# Altium project uz_mz_adapter.PrjPcb
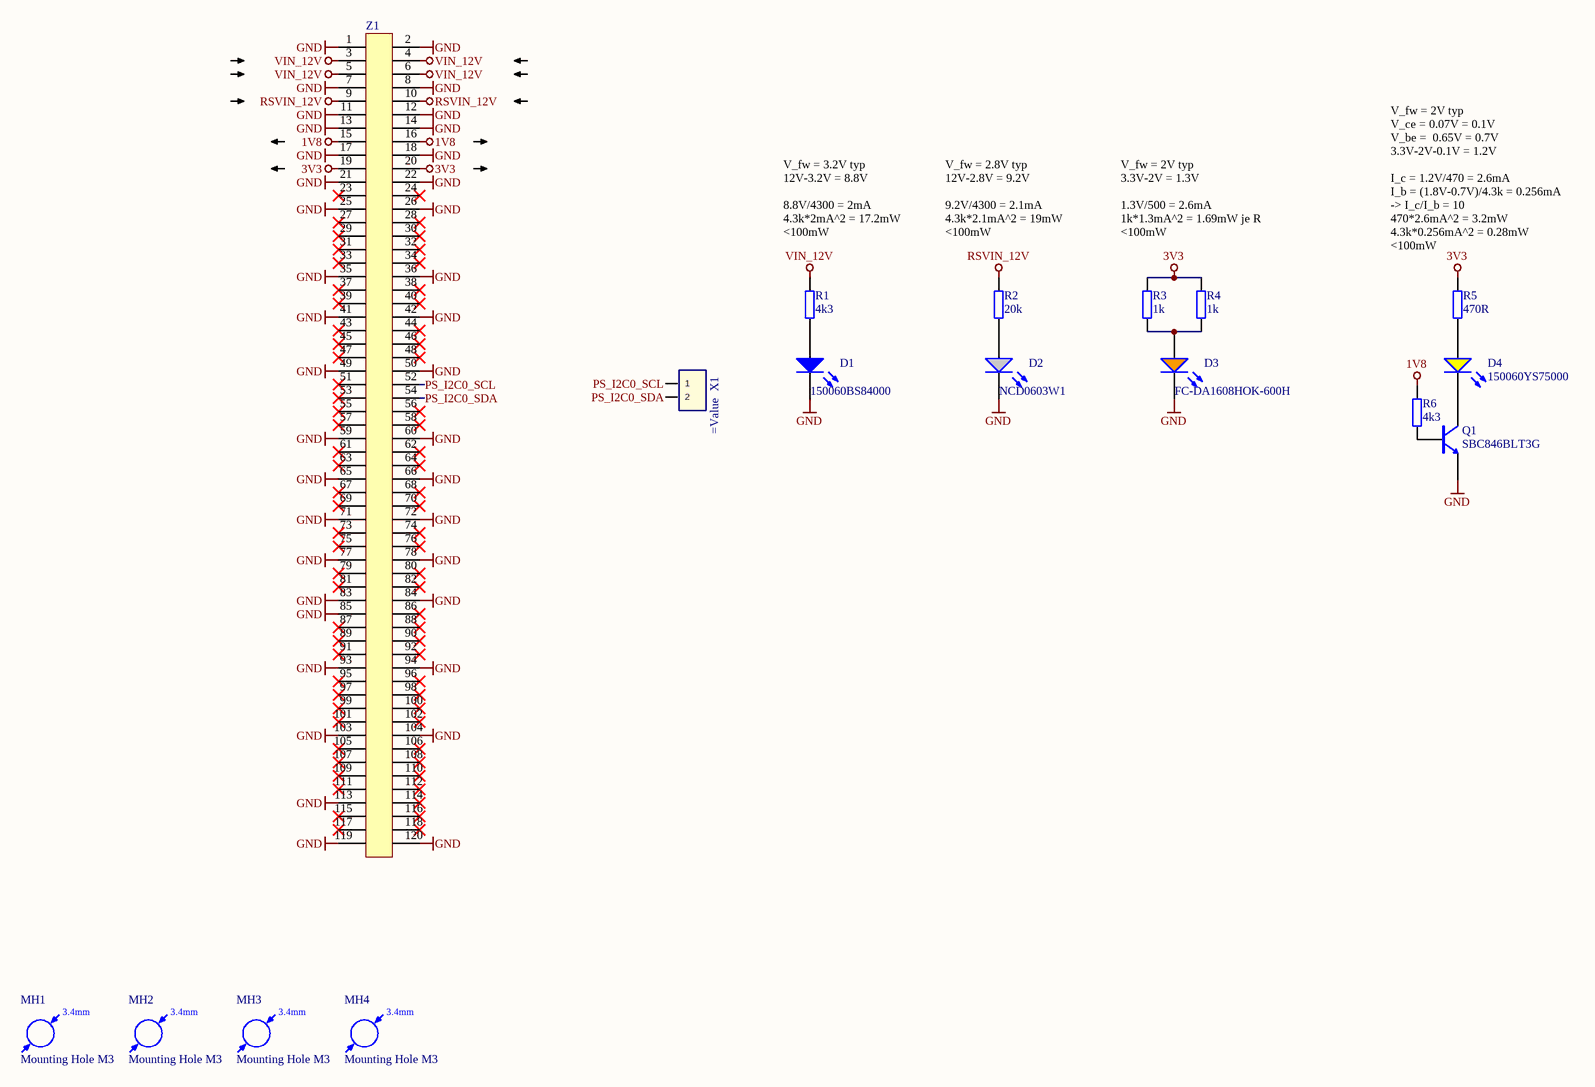
[diagram p0: ZB1.SchDoc]
AuthorParam: R. Weimer; Project: uz_mz_adapter; ProjectDate: 06/2026; ProjectRevision: Rev01
3 sheets, 36 parts. Net scope: global (net labels, ports and power ports of the same name join across sheets).
Board file: uz_mz_adapter.PcbDoc
Sheets:
  ZB1.SchDoc
  ZB2.SchDoc
  ZB3.SchDoc

## Sheet ZB1.SchDoc
size A3; SheetNumber: 1; SheetTotal: 3

### Parts
D1  150060BS84000  [WL-SMCW_0603]
D2  NCD0603W1  [WL-SMCW_0603]
D3  FC-DA1608HOK-600H  [WL-SMCW_0603]
D4  150060YS75000  [WL-SMCW_0603]
MH1  Mounting Hole M3  [MH_3.4]  (no BOM)
MH2  Mounting Hole M3  [MH_3.4]  (no BOM)
MH3  Mounting Hole M3  [MH_3.4]  (no BOM)
MH4  Mounting Hole M3  [MH_3.4]  (no BOM)
Q1  SBC846BLT3G  [SOT-23-3_ONSC]
R1  4k3  [RES 0603_1608]
R2  20k  [RES 0603_1608]
R3  1k  [RES 0603_1608]
R4  1k  [RES 0603_1608]
R5  470R  [RES 0603_1608]
R6  4k3  [RES 0603_1608]
X1  (no value)  [TSW-102-XX-XXX-S]
Z1  (no value)  [ERM8-060-02.0-L-DV]

### Nets
1V8: R6.2 Z1.15 Z1.16
3V3: R3.2 R4.2 R5.2 Z1.19 Z1.20
GND: D1.1(K) D2.1(K) D3.1(K) Q1.2(EMITTER) Z1.1 Z1.2 Z1.7 Z1.8 Z1.11 Z1.12 Z1.13 Z1.14 Z1.17 Z1.18 Z1.21 Z1.22 Z1.25 Z1.26 Z1.35 Z1.36 Z1.41 Z1.42 Z1.49 Z1.50 Z1.59 Z1.60 Z1.65 Z1.66 Z1.71 Z1.72 Z1.77 Z1.78 Z1.83 Z1.84 Z1.85 Z1.93 Z1.94 Z1.103 Z1.104 Z1.113 Z1.119 Z1.120
RSVIN_12V: R2.2 Z1.9 Z1.10
VIN_12V: R1.2 Z1.3 Z1.4 Z1.5 Z1.6
PS_I2C0_SCL: X1.1 Z1.52
PS_I2C0_SDA: X1.2 Z1.54
NetD1_2: D1.2(A) R1.1
NetD2_2: D2.2(A) R2.1
NetD3_2: D3.2(A) R3.1 R4.1
NetD4_1: D4.1(K) Q1.3(COLLECTOR)
NetD4_2: D4.2(A) R5.1
NetQ1_1: Q1.1(BASIS) R6.1

Not connected (* = marked no-connect by the designer): Z1 23* 24* 27* 28* 29* 30* 31* 32* 33* 34* 37* 38* 39* 40* 43* 44* 45* 46* 47* 48* 51* 53* 55* 56* 57* 58* 61* 62* 63* 64* 67* 68* 69* 70* 73* 74* 75* 76* 79* 80* 81* 82* 86* 87* 88* 89* 90* 91* 92* 95* 96* 97* 98* 99* 100* 101* 102* 105* 106* 107* 108* 109* 110* 111* 112* 114* 115* 116* 117* 118*

### Notes on the sheet
- V_fw = 3.2V typ
  12V-3.2V = 8.8V
  8.8V/4300 = 2mA
  4.3k*2mA^2 = 17.2mW
  <100mW
- V_fw = 2.8V typ
  12V-2.8V = 9.2V
  9.2V/4300 = 2.1mA
  4.3k*2.1mA^2 = 19mW
  <100mW
- V_fw = 2V typ
  3.3V-2V = 1.3V
  1.3V/500 = 2.6mA
  1k*1.3mA^2 = 1.69mW je R
  <100mW
- (near R5) V_fw = 2V typ
  V_ce = 0.07V = 0.1V
  V_be =  0.65V = 0.7V
  3.3V-2V-0.1V = 1.2V
  I_c = 1.2V/470 = 2.6mA
  I_b = (1.8V-0.7V)/4.3k = 0.256mA
  -> I_c/I_b = 10
  470*2.6mA^2 = 3.2mW
  4.3k*0.256mA^2 = 0.28mW
  <100mW
- Title
- Revision:
- Design Engineer:
- Date:
- Project:
- Sheet
- of
- (in symbol Mounting Hole) 3.4mm

### Library data of the parts
D1 = 150060BS84000: WL-SMCW SMD Mono-color Chip LED Waterclear Blue; Manufacturer: Wuerth Elektronik; Type: Standard; Created from: MGremer; Forward Current I_f: 20 mA; Forward Voltage U_f: 3.2 V; Wavelength: 470 nm; Light Intensity: 560 mcd; Nominal Power: 78 mW; Manufacturer Part Number: 150060BS84000; PartID: 1; Created On: 08.12.2020 10:19:38; ComponentLink1Description: Datasheet; ComponentLink1URL: https://www.we-online.com/components/products/datasheet/150060BS75000.pdf; Component Type: LED Diode; Device Package: 0603; Last Updated: 22.04.2026 11:55:05; Mounting Type: SMD; Operating Temperature: -40 - 85 °C; Supplier 1: Mouser; Supplier Part Number 1: 710-150060BS84000; Supplier 2: Farnell; Supplier Part Number 2: 3408611; Supplier 3: Digi-Key; Supplier Part Number 3: 732-150060BS84000CT-ND; Live Cycle Status: 1; Stock number: not stored; Color: blue; LCSC Part Number: C5197644
D2 = NCD0603W1: White light 0603 Light Emitting Diodes (LED) ROHS; Manufacturer: Foshan NationStar Optoelectronics; Type: Standard; Created from: NDiringer; Forward Current I_f: 20 mA; Forward Voltage U_f: 2.8 V; Light Intensity: 250 mcd; Nominal Power: 72 mW; Manufacturer Part Number: NCD0603W1; PartID: 13; Created On: 03.05.2022 13:11:03; ComponentLink1Description: Datasheet; ComponentLink1URL: https://www.lcsc.com/datasheet/C84265.pdf; Component Type: LED Diode; Device Package: 0603; Last Updated: 22.04.2026 11:55:05; Mounting Type: SMD; Operating Temperature: -40 - 85 °C; Supplier 1: LCSC; Supplier Part Number 1: C84265; Live Cycle Status: 1; Stock number: not stored; Color: white; LCSC Part Number: C84265
D3 = FC-DA1608HOK-600H: LED ORANGE 600~610NM 80~220MCD@20MA TOP VIEW 0603 ROHS; Manufacturer: Foshan NationStar Optoelectronics; Type: Standard; Created from: T. Wendt; Color: amber; Forward Current I_f: 20 mA; Forward Voltage U_f: 2 V; Wavelength: 604 nm; Light Intensity: 150 mcd; Nominal Power: 40 mW; Manufacturer Part Number: FC-DA1608HOK-600H; PartID: 10; Created On: 03.03.2021 09:59:51; ComponentLink1Description: Datasheet; ComponentLink1URL: https://www.lcsc.com/datasheet/C84269.pdf; Component Type: LED Diode; Device Package: 0603; Last Updated: 22.04.2026 11:55:05; Mounting Type: SMD; Operating Temperature: -40 - 85 °C; Supplier 1: LCSC; Supplier Part Number 1: C84269; Live Cycle Status: 1; Stock number: not stored; LCSC Part Number: C84269
D4 = 150060YS75000: LED Yellow 20mA 2V 0603; Manufacturer: Wuerth Elektronik; Type: Standard; Created from: RWeimer; Wavelength: 590 nm; Manufacturer Part Number: 150060YS75000; PartID: 37; Created On: 03.06.2026 10:18:01; ComponentLink1Description: Datasheet; ComponentLink1URL: https://www.we-online.com/components/products/datasheet/150060YS75000.pdf; Component Type: LED Diode; Device Package: 0603; Last Updated: 03.06.2026 10:18:43; Mounting Type: SMD; Operating Temperature: -40 to +85 °C; Supplier 1: LCSC; Supplier Part Number 1: C6784997; Value: LED Yellow; Live Cycle Status: 1; Stock number: not stored; Color: yellow; Forward Current I_f: 20 mA; Forward Voltage U_f: 2 V; LCSC Part Number: C6784997
MH1-MH4 = Mounting Hole: Created from: MHlatky; Manufacturer Part Number: Mounting Hole M3; PartID: 16; Created On: 26.01.2021 09:19:51; ComponentLink1Description: Datasheet; Component Type: Mounting Hole; Device Package: -; Last Updated: 21.03.2022 23:05:12; Manufacturer: Mounting Hole; Supplier 1: Mounting Hole; Supplier Part Number 1: Mounting Hole; Type: Mounting Hole; Value: Mounting Hole; Live Cycle Status: 1; Stock number: not stored
Q1 = SBC846BLT3G: Bipolartransistor, NPN 100mA 80V; Manufacturer: onsemi; Number Of Channels: single; Collector Emitter Voltage: 65 V; Power Dissipation: 225 mW; Value: 65 V; Created from: RWeimer; Manufacturer Part Number: SBC846BLT3G; PartID: 7; Created On: 22.06.2026 10:09:39; ComponentLink1Description: Datasheet; ComponentLink1URL: https://www.lcsc.com/datasheet/C896883.pdf; Component Type: Bipolartransistor; Device Package: SOT-23-3; Last Updated: 22.06.2026 10:09:39; Mounting Type: SMD; Operating Temperature: -55 - +150°C; Series: BC846BL; Supplier 1: Mouser; Supplier Part Number 1: 863-SBC846BLT3G; Supplier 2: LCSC; Supplier Part Number 2: C896883; Type: Bipolartransistor; Collector Basis Voltage: 80 V; Polarization: NPN; Live Cycle Status: 1; LCSC Part Number: C896883
R1 R6 = RK73B1JTTD432J: SMD resistor E24 series; Manufacturer: KOA Speer; Tolerance: 5%; Created from: MGremer; Manufacturer Part Number: RK73B1JTTD432J; PartID: 89; Created On: 14.12.2020 16:17:14; ComponentLink1Description: Datasheet; ComponentLink1URL: https://www.mouser.de/datasheet/2/219/RK73B-1825463.pdf; Component Type: SMD resistor; Device Package: 0603; Last Updated: 10.04.2026 07:56:16; Mounting Type: SMD; Supplier 1: Mouser; Supplier Part Number 1: 660-RK73B1JTTD432J; Type: Resistor; Value: 4k3; Live Cycle Status: 1; Stock number: Labor SMD Container; LCSC Part Number: C307285
R2 = 0603WAF2002T5E: SMD resistor E24 series; Manufacturer: UNI-ROYAL; Tolerance: 1%; Created from: AGeiger; Manufacturer Part Number: 0603WAF2002T5E; PartID: 105; Created On: 14.12.2020 16:17:14; ComponentLink1Description: Datasheet; ComponentLink1URL: https://datasheet.lcsc.com/lcsc/2206010230_UNI-ROYAL-Uniroyal-Elec-0603WAF2002T5E_C4184.pdf; Component Type: SMD resistor; Device Package: 0603; Last Updated: 25.08.2022 20:05:50; Mounting Type: SMD; Supplier 1: LCSC; Supplier Part Number 1: C4184; Type: Resistor; Value: 20k; Live Cycle Status: 1; Stock number: Labor SMD Container; LCSC Part Number: C4184
R3 R4 = 0603WAF1001T5E: SMD resistor E24 series; Manufacturer: UNI-ROYAL; Tolerance: 1%; Created from: AGeiger; Manufacturer Part Number: 0603WAF1001T5E; PartID: 74; Created On: 14.12.2020 16:17:14; ComponentLink1Description: Datasheet; ComponentLink1URL: https://datasheet.lcsc.com/lcsc/2206010130_UNI-ROYAL-Uniroyal-Elec-0603WAF1001T5E_C21190.pdf; Component Type: SMD resistor; Device Package: 0603; Last Updated: 25.08.2022 16:01:46; Mounting Type: SMD; Supplier 1: LCSC; Supplier Part Number 1: C21190; Type: Resistor; Value: 1k; Live Cycle Status: 1; Stock number: Labor SMD Container; LCSC Part Number: C21190
R5 = RK73B1JTTD471J: SMD resistor E24 series; Manufacturer: KOA Speer; Tolerance: 5%; Created from: MGremer; Manufacturer Part Number: RK73B1JTTD471J; PartID: 66; Created On: 14.12.2020 16:17:14; ComponentLink1Description: Datasheet; ComponentLink1URL: https://www.mouser.de/datasheet/2/219/RK73B-1825463.pdf; Component Type: SMD resistor; Device Package: 0603; Last Updated: 04.03.2021 10:03:02; Mounting Type: SMD; Supplier 1: Mouser; Supplier Part Number 1: 660-RK73B1JTTD471J; Supplier 2: LCSC; Supplier Part Number 2: C23179; Type: Resistor; Value: 470R; Live Cycle Status: 1; Stock number: Labor SMD Container; LCSC Part Number: C23179
X1 = TSW-102-07-L-S: Classic PCB Header Strips, 0.100" pitch; MANUFACTURER: SAMTEC; Created from: AGeiger; CREATED BY: May 18, 2016 - Wendy Xin; PCB DECAL: TSW-102-XX-XXX-S; LCSC Part Number: C492401; Manufacturer Part Number: TSW-102-07-L-S; PartID: 20; Created On: 26.06.2023 09:51:05; ComponentLink1Description: Datasheet; ComponentLink1URL: https://suddendocs.samtec.com/catalog_english/tsw_th.pdf; Last Updated: 26.06.2023 09:53:59; Mounting Type: SMD; Operating Temperature: -55 °C to +105 °C; Series: TSW; Supplier 1: LCSC; Supplier Part Number 1: C492401; Value: TSW-102-07-L-S
Z1 = ERM8-060-02.0-L-DV-TR: 0.80 mm Edge Rate Rugged High Speed; Manufacturer: SAMTEC; Created from: AGeiger; Manufacturer Part Number: ERM8-060-02.0-L-DV-TR; PartID: 61; Created On: 15.08.2025 09:35:44; ComponentLink1Description: Datasheet; ComponentLink1URL: https://suddendocs.samtec.com/catalog_english/erm8.pdf; Last Updated: 23.09.2025 10:14:21; Mounting Type: SMD; Operating Temperature: -55 °C to +125 °C; Series: ERM8; Supplier 1: LCSC; Supplier Part Number 1: C3649339; Value: ERM8-060-02.0-L-DV-TR; LCSC Part Number: C3649339

## Sheet ZB2.SchDoc
size A3; SheetNumber: 2; SheetTotal: 3; ENG_APP_DATE: --/--/--; DSN_APP_DATE: --/--/--; CHK_APP_DATE: --/--/--
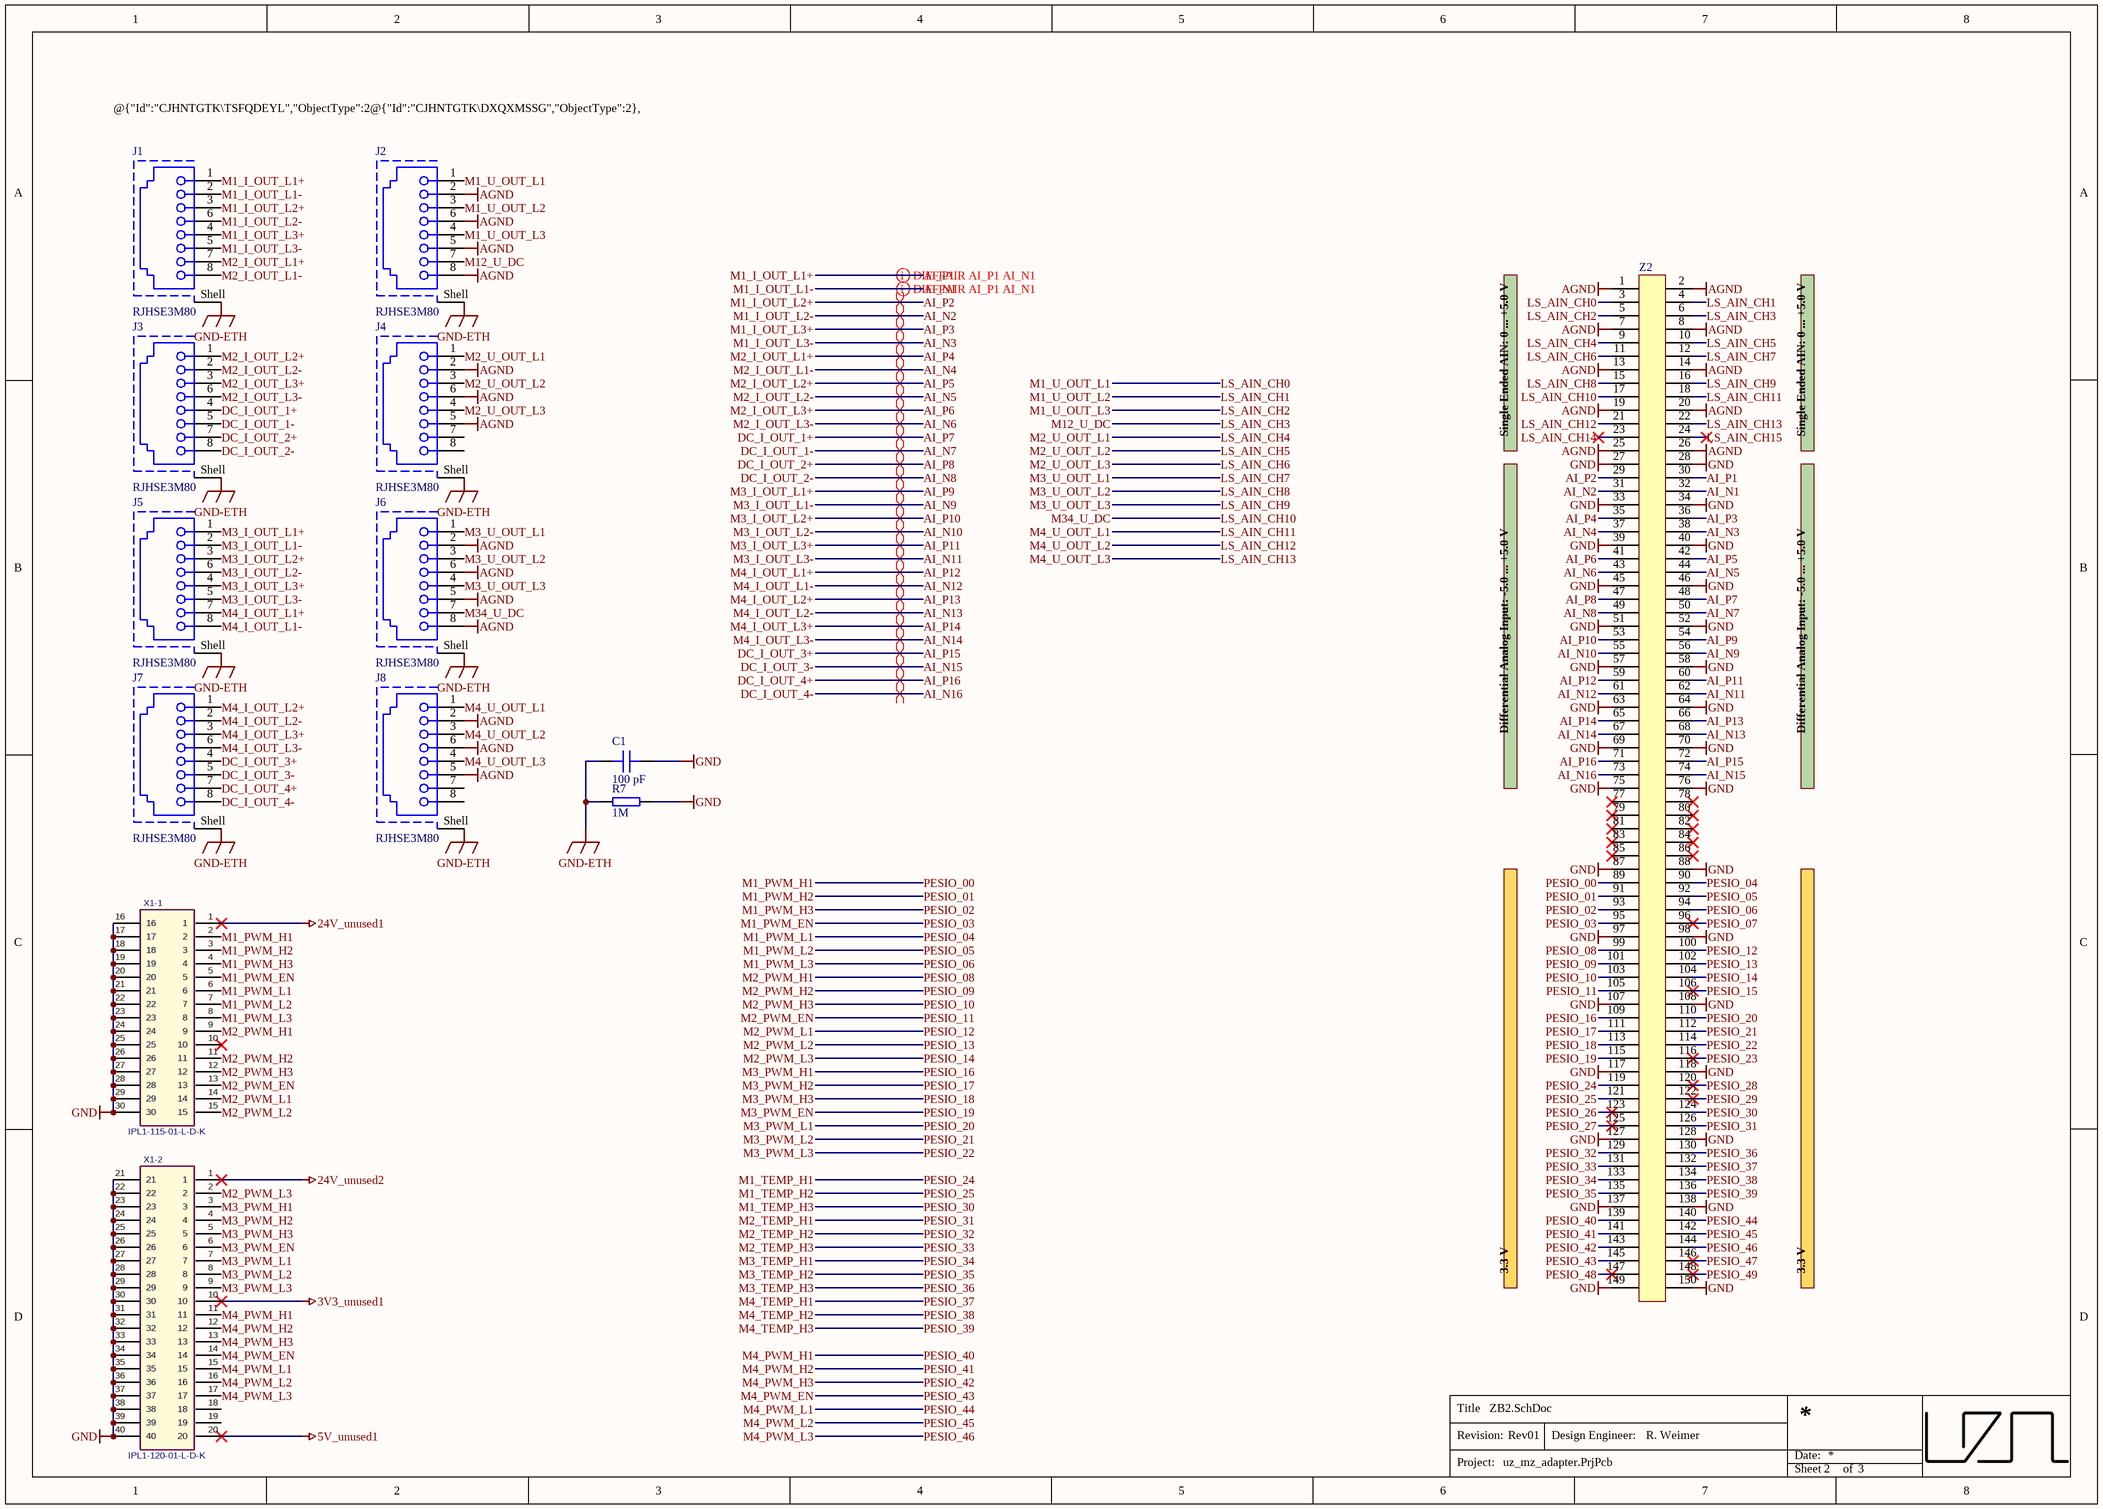
[diagram p1: ZB2.SchDoc]

### Parts
C1  100 pF  [C_1206_TE]
J1  RJHSE3M80  [RJHSE3M80]
J2  RJHSE3M80  [RJHSE3M80]
J3  RJHSE3M80  [RJHSE3M80]
J4  RJHSE3M80  [RJHSE3M80]
J5  RJHSE3M80  [RJHSE3M80]
J6  RJHSE3M80  [RJHSE3M80]
J7  RJHSE3M80  [RJHSE3M80]
J8  RJHSE3M80  [RJHSE3M80]
R7  1M  [RES 1206_3216]
X1-1  IPL1-115-01-L-D-K  [IPL1-115-01-YYY-D-K]
X1-2  IPL1-120-01-L-D-K  [SAMTEC_IPL1-120-01-X-D-K]
Z2  (no value)  [ERM8-075-02.0-L-DV]

### Nets
3V3_unused1: X1-2.10
5V_unused1: X1-2.20
24V_unused1: X1-1.1
24V_unused2: X1-2.1
AGND: J2.2 J2.5 J2.6 J2.8 J4.2 J4.5 J4.6 J6.2 J6.5 J6.6 J6.8 J8.2 J8.5 J8.6 Z2.1 Z2.2 Z2.7 Z2.8 Z2.13 Z2.14 Z2.19 Z2.20 Z2.25 Z2.26
GND: C1.2 R7.2 X1-1.16 X1-1.17 X1-1.18 X1-1.19 X1-1.20 X1-1.21 X1-1.22 X1-1.23 X1-1.24 X1-1.25 X1-1.26 X1-1.27 X1-1.28 X1-1.29 X1-1.30 X1-2.21 X1-2.22 X1-2.23 X1-2.24 X1-2.25 X1-2.26 X1-2.27 X1-2.28 X1-2.29 X1-2.30 X1-2.31 X1-2.32 X1-2.33 X1-2.34 X1-2.35 X1-2.36 X1-2.37 X1-2.38 X1-2.39 X1-2.40 Z2.27 Z2.28 Z2.33 Z2.34 Z2.39 Z2.40 Z2.45 Z2.46 Z2.51 Z2.52 Z2.57 Z2.58 Z2.63 Z2.64 Z2.69 Z2.70 Z2.75 Z2.76 Z2.87 Z2.88 Z2.97 Z2.98 Z2.107 Z2.108 Z2.117 Z2.118 Z2.127 Z2.128 Z2.137 Z2.138 Z2.149 Z2.150
GND-ETH: C1.1 J1.Shell J2.Shell J3.Shell J4.Shell J5.Shell J6.Shell J7.Shell J8.Shell R7.1
AI_N1: J1.2 Z2.32  [also labelled M1_I_OUT_L1-]
AI_N2: J1.6 Z2.31  [also labelled M1_I_OUT_L2-]
AI_N3: J1.5 Z2.38  [also labelled M1_I_OUT_L3-]
AI_N4: J1.8 Z2.37  [also labelled M2_I_OUT_L1-]
AI_N5: J3.2 Z2.44  [also labelled M2_I_OUT_L2-]
AI_N6: J3.6 Z2.43  [also labelled M2_I_OUT_L3-]
AI_N7: J3.5 Z2.50  [also labelled DC_I_OUT_1-]
AI_N8: J3.8 Z2.49  [also labelled DC_I_OUT_2-]
AI_N9: J5.2 Z2.56  [also labelled M3_I_OUT_L1-]
AI_N10: J5.6 Z2.55  [also labelled M3_I_OUT_L2-]
AI_N11: J5.5 Z2.62  [also labelled M3_I_OUT_L3-]
AI_N12: J5.8 Z2.61  [also labelled M4_I_OUT_L1-]
AI_N13: J7.2 Z2.68  [also labelled M4_I_OUT_L2-]
AI_N14: J7.6 Z2.67  [also labelled M4_I_OUT_L3-]
AI_N15: J7.5 Z2.74  [also labelled DC_I_OUT_3-]
AI_N16: J7.8 Z2.73  [also labelled DC_I_OUT_4-]
AI_P1: J1.1 Z2.30  [also labelled M1_I_OUT_L1+]
AI_P2: J1.3 Z2.29  [also labelled M1_I_OUT_L2+]
AI_P3: J1.4 Z2.36  [also labelled M1_I_OUT_L3+]
AI_P4: J1.7 Z2.35  [also labelled M2_I_OUT_L1+]
AI_P5: J3.1 Z2.42  [also labelled M2_I_OUT_L2+]
AI_P6: J3.3 Z2.41  [also labelled M2_I_OUT_L3+]
AI_P7: J3.4 Z2.48  [also labelled DC_I_OUT_1+]
AI_P8: J3.7 Z2.47  [also labelled DC_I_OUT_2+]
AI_P9: J5.1 Z2.54  [also labelled M3_I_OUT_L1+]
AI_P10: J5.3 Z2.53  [also labelled M3_I_OUT_L2+]
AI_P11: J5.4 Z2.60  [also labelled M3_I_OUT_L3+]
AI_P12: J5.7 Z2.59  [also labelled M4_I_OUT_L1+]
AI_P13: J7.1 Z2.66  [also labelled M4_I_OUT_L2+]
AI_P14: J7.3 Z2.65  [also labelled M4_I_OUT_L3+]
AI_P15: J7.4 Z2.72  [also labelled DC_I_OUT_3+]
AI_P16: J7.7 Z2.71  [also labelled DC_I_OUT_4+]
LS_AIN_CH0: J2.1 Z2.3  [also labelled M1_U_OUT_L1]
LS_AIN_CH1: J2.3 Z2.4  [also labelled M1_U_OUT_L2]
LS_AIN_CH2: J2.4 Z2.5  [also labelled M1_U_OUT_L3]
LS_AIN_CH3: J2.7 Z2.6  [also labelled M12_U_DC]
LS_AIN_CH4: J4.1 Z2.9  [also labelled M2_U_OUT_L1]
LS_AIN_CH5: J4.3 Z2.10  [also labelled M2_U_OUT_L2]
LS_AIN_CH6: J4.4 Z2.11  [also labelled M2_U_OUT_L3]
LS_AIN_CH7: J6.1 Z2.12  [also labelled M3_U_OUT_L1]
LS_AIN_CH8: J6.3 Z2.15  [also labelled M3_U_OUT_L2]
LS_AIN_CH9: J6.4 Z2.16  [also labelled M3_U_OUT_L3]
LS_AIN_CH10: J6.7 Z2.17  [also labelled M34_U_DC]
LS_AIN_CH11: J8.1 Z2.18  [also labelled M4_U_OUT_L1]
LS_AIN_CH12: J8.3 Z2.21  [also labelled M4_U_OUT_L2]
LS_AIN_CH13: J8.4 Z2.22  [also labelled M4_U_OUT_L3]
LS_AIN_CH14: Z2.23
LS_AIN_CH15: Z2.24
M1_PWM_EN: X1-1.5 Z2.95  [also labelled PESIO_03]
M1_PWM_H1: X1-1.2 Z2.89  [also labelled PESIO_00]
M1_PWM_H2: X1-1.3 Z2.91  [also labelled PESIO_01]
M1_PWM_H3: X1-1.4 Z2.93  [also labelled PESIO_02]
M1_PWM_L1: X1-1.6 Z2.90  [also labelled PESIO_04]
M1_PWM_L2: X1-1.7 Z2.92  [also labelled PESIO_05]
M1_PWM_L3: X1-1.8 Z2.94  [also labelled PESIO_06]
M1_TEMP_H1: Z2.119  [also labelled PESIO_24]
M1_TEMP_H2: Z2.121  [also labelled PESIO_25]
M1_TEMP_H3: Z2.124  [also labelled PESIO_30]
M2_PWM_EN: X1-1.13 Z2.105  [also labelled PESIO_11]
M2_PWM_H1: X1-1.9 Z2.99  [also labelled PESIO_08]
M2_PWM_H2: X1-1.11 Z2.101  [also labelled PESIO_09]
M2_PWM_H3: X1-1.12 Z2.103  [also labelled PESIO_10]
M2_PWM_L1: X1-1.14 Z2.100  [also labelled PESIO_12]
M2_PWM_L2: X1-1.15 Z2.102  [also labelled PESIO_13]
M2_PWM_L3: X1-2.2 Z2.104  [also labelled PESIO_14]
M2_TEMP_H1: Z2.126  [also labelled PESIO_31]
M2_TEMP_H2: Z2.129  [also labelled PESIO_32]
M2_TEMP_H3: Z2.131  [also labelled PESIO_33]
M3_PWM_EN: X1-2.6 Z2.115  [also labelled PESIO_19]
M3_PWM_H1: X1-2.3 Z2.109  [also labelled PESIO_16]
M3_PWM_H2: X1-2.4 Z2.111  [also labelled PESIO_17]
M3_PWM_H3: X1-2.5 Z2.113  [also labelled PESIO_18]
M3_PWM_L1: X1-2.7 Z2.110  [also labelled PESIO_20]
M3_PWM_L2: X1-2.8 Z2.112  [also labelled PESIO_21]
M3_PWM_L3: X1-2.9 Z2.114  [also labelled PESIO_22]
M3_TEMP_H1: Z2.133  [also labelled PESIO_34]
M3_TEMP_H2: Z2.135  [also labelled PESIO_35]
M3_TEMP_H3: Z2.130  [also labelled PESIO_36]
M4_PWM_EN: X1-2.14 Z2.145  [also labelled PESIO_43]
M4_PWM_H1: X1-2.11 Z2.139  [also labelled PESIO_40]
M4_PWM_H2: X1-2.12 Z2.141  [also labelled PESIO_41]
M4_PWM_H3: X1-2.13 Z2.143  [also labelled PESIO_42]
M4_PWM_L1: X1-2.15 Z2.140  [also labelled PESIO_44]
M4_PWM_L2: X1-2.16 Z2.142  [also labelled PESIO_45]
M4_PWM_L3: X1-2.17 Z2.144  [also labelled PESIO_46]
M4_TEMP_H1: Z2.132  [also labelled PESIO_37]
M4_TEMP_H2: Z2.134  [also labelled PESIO_38]
M4_TEMP_H3: Z2.136  [also labelled PESIO_39]
PESIO_07: Z2.96
PESIO_15: Z2.106
PESIO_23: Z2.116
PESIO_26: Z2.123
PESIO_27: Z2.125
PESIO_28: Z2.120
PESIO_29: Z2.122
PESIO_47: Z2.146
PESIO_48: Z2.147
PESIO_49: Z2.148

Not connected (* = marked no-connect by the designer): J4 7 8; J8 7 8; X1-1 10*; X1-2 18 19; Z2 77* 78* 79* 80* 81* 82* 83* 84* 85* 86*

### Layout directives
differential pair: AI_N1, AI_N2, AI_N3, AI_N4, AI_N5, AI_N6, AI_N7, AI_N8, AI_N9, AI_N10, AI_N11, AI_N12, AI_N13, AI_N14, AI_N15, AI_N16, AI_P1, AI_P2, AI_P3, AI_P4, AI_P5, AI_P6, AI_P7, AI_P8, AI_P9, AI_P10, AI_P11, AI_P12, AI_P13, AI_P14, AI_P15, AI_P16

### Notes on the sheet
- @{"Id":"CJHNTGTK\TSFQDEYL","ObjectType":2}, @{"Id":"CJHNTGTK\HTRMMLFJ","ObjectType":2}, @{"Id":"CJHNTGTK\ANRNPEXK","ObjectType":2}, @{"Id":"CJHNTGTK\OAQMETMZ","ObjectType":2} geht auf LTC2325
- @{"Id":"CJHNTGTK\DXQXMSSG","ObjectType":2}, @{"Id":"CJHNTGTK\IYSWADTS","ObjectType":2}, @{"Id":"CJHNTGTK\YMBDAVPH","ObjectType":2}, @{"Id":"CJHNTGTK\LNKFKSJG","ObjectType":2} geht auf MAX11331
- Single Ended AIN: 0 ... +5.0 V
- Differential Analog Input: -5.0 ... +5.0 V
- 3.3 V
- Title
- Revision:
- Design Engineer:
- Date:
- Project:
- Sheet
- of

### Library data of the parts
C1 = CC1206JKNPODBN101: 2kV 100pF NP0 ±5% 1206 Multilayer Ceramic Capacitors MLCC - SMD/SMT ROHS; Manufacturer: YAGEO; Voltage Rating: 2000 VDC; Created from: AGeiger; Manufacturer Part Number: CC1206JKNPODBN101; PartID: 115; Created On: 02.12.2022 11:59:53; ComponentLink1Description: Datasheet; ComponentLink1URL: https://datasheet.lcsc.com/lcsc/2108131530_YAGEO-CC1206JKNPODBN101_C113876.pdf; Component Type: Capacitor 1206; Device Package: 1206; Last Updated: 22.04.2025 15:53:45; Mounting Type: SMD; Operating Temperature: -55 to +125°C; Series: NP0; Supplier 1: LCSC; Supplier Part Number 1: C113876; Type: Capacitor; Tolerance: 5 %; Value: 100 pF; Live Cycle Status: 1; LCSC Part Number: C113876
J1-J8 = RJHSE3M80: CAT5, RJ45 Connector, 1 port, vertical; Manufacturer: Amphenol; Created from: DHufnagel; Manufacturer Part Number: RJHSE3M80; PartID: 12; Created On: 06.06.2023 05:55:53; ComponentLink1Description: Datasheet; ComponentLink1URL: https://cdn.amphenol-cs.com/media/wysiwyg/files/documentation/datasheet/inputoutput/io-modjack-rjhse.pdf; Component Type: RJ45 Connector; Device Package: RJ45; Last Updated: 06.06.2023 05:55:53; Mounting Type: THT; Series: RJHSE; Supplier 1: Mouser; Supplier Part Number 1: 523-RJHSE3M80; Supplier 2: LCSC; Supplier Part Number 2: C3179193; Type: RJ45 Connector; Live Cycle Status: 1; LCSC Part Number: C3179193; Stock number: not stored
R7 = 1206W4F1004T5E: 250mW Thick Film Resistors 200V ±100ppm/℃ ±1% -55℃~+155℃ 1MΩ 1206 Chip Resistor - Surface Mount ROHS; Manufacturer: UNI-ROYAL; Created from: AGeiger; Manufacturer Part Number: 1206W4F1004T5E; PartID: 248; Created On: 02.12.2022 11:50:50; ComponentLink1Description: Datasheet; ComponentLink1URL: https://datasheet.lcsc.com/lcsc/2206010145_UNI-ROYAL-Uniroyal-Elec-1206W4F1004T5E_C17927.pdf; Component Type: SMD resistor; Device Package: 1206; Last Updated: 02.12.2022 11:50:50; Mounting Type: SMD; Supplier 1: LCSC; Supplier Part Number 1: C17927; Type: Resistor; Tolerance: 1%; Value: 1M; Live Cycle Status: 1; LCSC Part Number: C17927
X1-1 = IPL1-115-01-L-D-K: 2.54 mm Double Row Terminal Assembly; Manufacturer: SAMTEC; Created from: MGremer; Number of positions: 30; Manufacturer Part Number: IPL1-115-01-L-D-K; PartID: 28; Created On: 01.12.2020 18:14:32; ComponentLink1Description: Homepage; ComponentLink1URL: https://www.samtec.com/de/products/ipl1; Component Type: Samtec Connector; Device Package: Connector; Last Updated: 15.02.2021 10:08:03; Mounting Type: THT; Supplier 1: SAMTEC; Supplier Part Number 1: IPL1-115-01-L-D-K; Type: Connector; Live Cycle Status: 1; Number of rows: 2; Stock number: not stored
X1-2 = IPL1-120-01-L-D-K: Terminal Assembly, Double Row, Thru-Hole, 2.54 mm x 2.54 mm Pitch, 40 Pins; Manufacturer: SAMTEC; Created from: PBaumann; Number of positions: 40; Manufacturer Part Number: IPL1-120-01-L-D-K; PartID: 42; Created On: 24.03.2021 02:48:34; ComponentLink1Description: Homepage; ComponentLink1URL: https://www.samtec.com/products/ipl1; Component Type: Samtec Connector; Device Package: Connector; Last Updated: 27.05.2022 12:12:18; Mounting Type: THT; Supplier 1: SAMTEC; Supplier Part Number 1: IPL1-120-01-L-D-K; Type: Connector; Live Cycle Status: 1; Number of rows: 2; Stock number: not stored
Z2 = ERM8-075-02.0-L-DV-TR: 0.80 mm Edge Rate Rugged High Speed; Manufacturer: SAMTEC; Created from: AGeiger; Manufacturer Part Number: ERM8-075-02.0-L-DV-TR; PartID: 62; Created On: 15.08.2025 09:35:44; ComponentLink1Description: Datasheet; ComponentLink1URL: https://suddendocs.samtec.com/catalog_english/erm8.pdf; Last Updated: 23.09.2025 10:14:21; Mounting Type: SMD; Operating Temperature: -55 °C to +125 °C; Series: ERM8; Supplier 1: LCSC; Supplier Part Number 1: C6845629; Value: ERM8-075-02.0-L-DV-TR; LCSC Part Number: C6845629

## Sheet ZB3.SchDoc
size A3; SheetNumber: 3; SheetTotal: 3
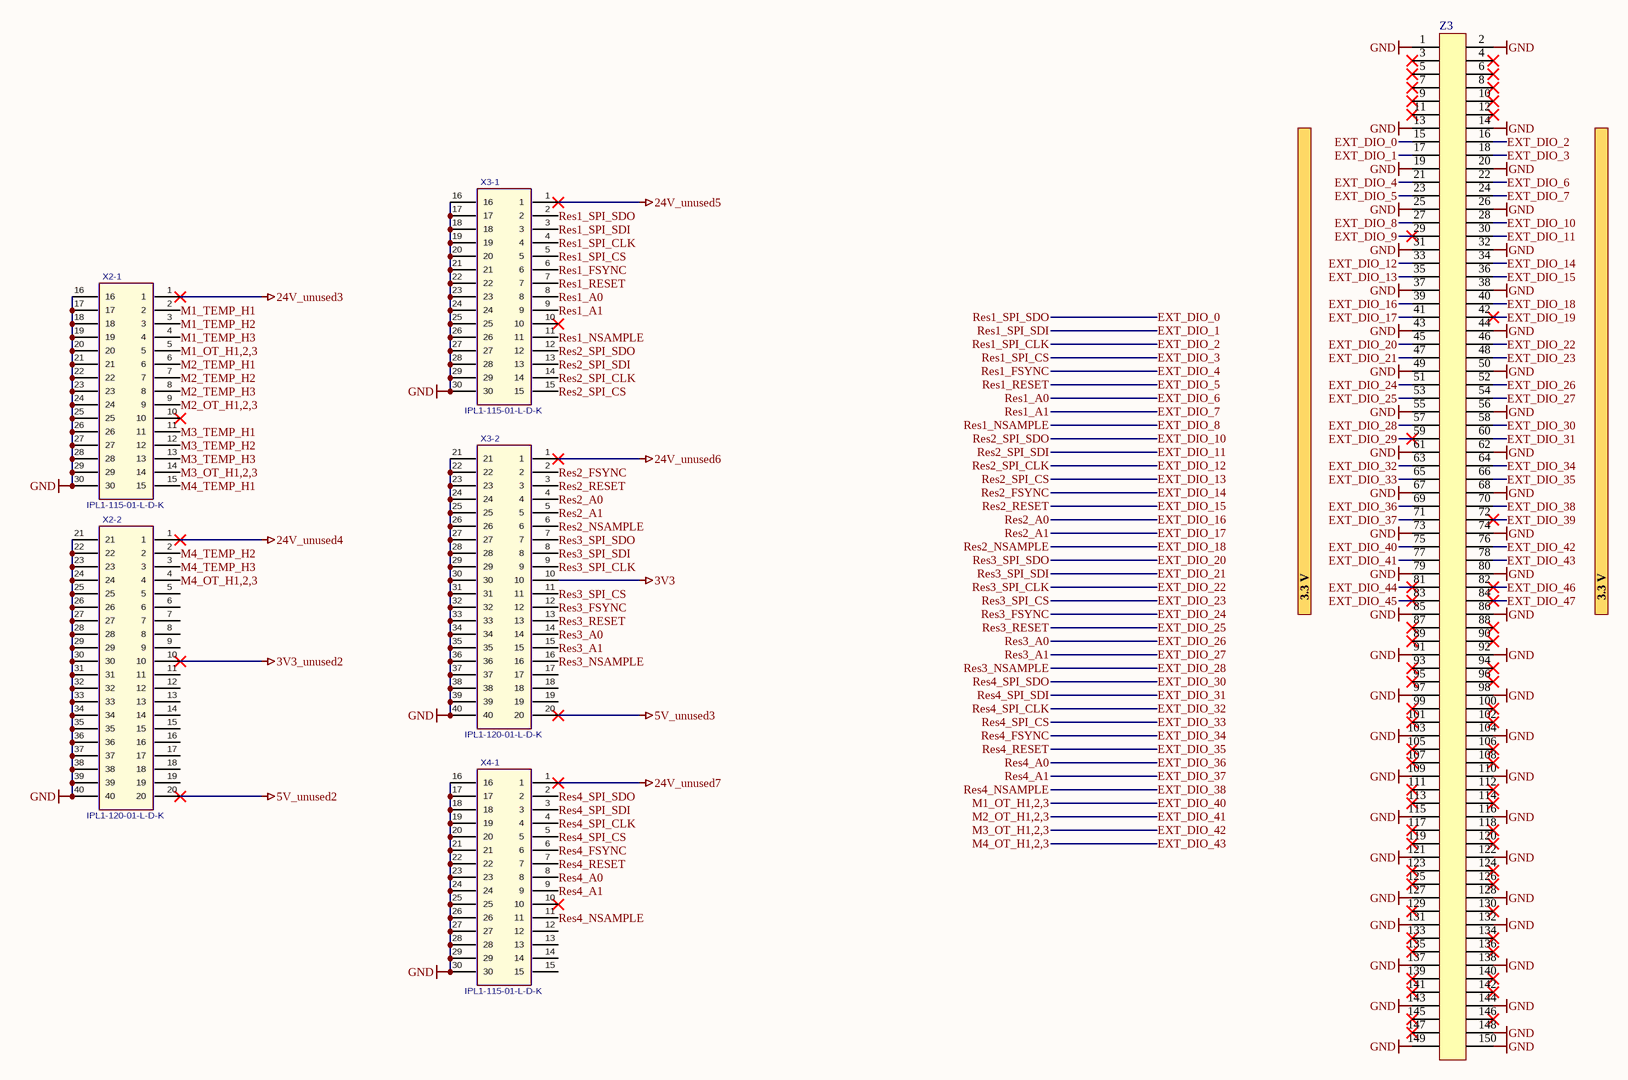
[diagram p2: ZB3.SchDoc]

### Parts
X2-1  IPL1-115-01-L-D-K  [IPL1-115-01-YYY-D-K]
X2-2  IPL1-120-01-L-D-K  [SAMTEC_IPL1-120-01-X-D-K]
X3-1  IPL1-115-01-L-D-K  [IPL1-115-01-YYY-D-K]
X3-2  IPL1-120-01-L-D-K  [SAMTEC_IPL1-120-01-X-D-K]
X4-1  IPL1-115-01-L-D-K  [IPL1-115-01-YYY-D-K]
Z3  (no value)  [ERM8-075-02.0-L-DV]

### Nets
3V3: X3-2.10
3V3_unused2: X2-2.10
5V_unused2: X2-2.20
5V_unused3: X3-2.20
24V_unused3: X2-1.1
24V_unused4: X2-2.1
24V_unused5: X3-1.1
24V_unused6: X3-2.1
24V_unused7: X4-1.1
GND: X2-1.16 X2-1.17 X2-1.18 X2-1.19 X2-1.20 X2-1.21 X2-1.22 X2-1.23 X2-1.24 X2-1.25 X2-1.26 X2-1.27 X2-1.28 X2-1.29 X2-1.30 X2-2.21 X2-2.22 X2-2.23 X2-2.24 X2-2.25 X2-2.26 X2-2.27 X2-2.28 X2-2.29 X2-2.30 X2-2.31 X2-2.32 X2-2.33 X2-2.34 X2-2.35 X2-2.36 X2-2.37 X2-2.38 X2-2.39 X2-2.40 X3-1.16 X3-1.17 X3-1.18 X3-1.19 X3-1.20 X3-1.21 X3-1.22 X3-1.23 X3-1.24 X3-1.25 X3-1.26 X3-1.27 X3-1.28 X3-1.29 X3-1.30 X3-2.21 X3-2.22 X3-2.23 X3-2.24 X3-2.25 X3-2.26 X3-2.27 X3-2.28 X3-2.29 X3-2.30 X3-2.31 X3-2.32 X3-2.33 X3-2.34 X3-2.35 X3-2.36 X3-2.37 X3-2.38 X3-2.39 X3-2.40 X4-1.16 X4-1.17 X4-1.18 X4-1.19 X4-1.20 X4-1.21 X4-1.22 X4-1.23 X4-1.24 X4-1.25 X4-1.26 X4-1.27 X4-1.28 X4-1.29 X4-1.30 Z3.1 Z3.2 Z3.13 Z3.14 Z3.19 Z3.20 Z3.25 Z3.26 Z3.31 Z3.32 Z3.37 Z3.38 Z3.43 Z3.44 Z3.49 Z3.50 Z3.55 Z3.56 Z3.61 Z3.62 Z3.67 Z3.68 Z3.73 Z3.74 Z3.79 Z3.80 Z3.85 Z3.86 Z3.91 Z3.92 Z3.97 Z3.98 Z3.103 Z3.104 Z3.109 Z3.110 Z3.115 Z3.116 Z3.121 Z3.122 Z3.127 Z3.128 Z3.131 Z3.132 Z3.137 Z3.138 Z3.143 Z3.144 Z3.148 Z3.149 Z3.150
EXT_DIO_0: X3-1.2 Z3.15  [also labelled Res1_SPI_SDO]
EXT_DIO_1: X3-1.3 Z3.17  [also labelled Res1_SPI_SDI]
EXT_DIO_2: X3-1.4 Z3.16  [also labelled Res1_SPI_CLK]
EXT_DIO_3: X3-1.5 Z3.18  [also labelled Res1_SPI_CS]
EXT_DIO_4: X3-1.6 Z3.21  [also labelled Res1_FSYNC]
EXT_DIO_5: X3-1.7 Z3.23  [also labelled Res1_RESET]
EXT_DIO_6: X3-1.8 Z3.22  [also labelled Res1_A0]
EXT_DIO_7: X3-1.9 Z3.24  [also labelled Res1_A1]
EXT_DIO_8: X3-1.11 Z3.27  [also labelled Res1_NSAMPLE]
EXT_DIO_9: Z3.29
EXT_DIO_10: X3-1.12 Z3.28  [also labelled Res2_SPI_SDO]
EXT_DIO_11: X3-1.13 Z3.30  [also labelled Res2_SPI_SDI]
EXT_DIO_12: X3-1.14 Z3.33  [also labelled Res2_SPI_CLK]
EXT_DIO_13: X3-1.15 Z3.35  [also labelled Res2_SPI_CS]
EXT_DIO_14: X3-2.2 Z3.34  [also labelled Res2_FSYNC]
EXT_DIO_15: X3-2.3 Z3.36  [also labelled Res2_RESET]
EXT_DIO_16: X3-2.4 Z3.39  [also labelled Res2_A0]
EXT_DIO_17: X3-2.5 Z3.41  [also labelled Res2_A1]
EXT_DIO_18: X3-2.6 Z3.40  [also labelled Res2_NSAMPLE]
EXT_DIO_19: Z3.42
EXT_DIO_20: X3-2.7 Z3.45  [also labelled Res3_SPI_SDO]
EXT_DIO_21: X3-2.8 Z3.47  [also labelled Res3_SPI_SDI]
EXT_DIO_22: X3-2.9 Z3.46  [also labelled Res3_SPI_CLK]
EXT_DIO_23: X3-2.11 Z3.48  [also labelled Res3_SPI_CS]
EXT_DIO_24: X3-2.12 Z3.51  [also labelled Res3_FSYNC]
EXT_DIO_25: X3-2.13 Z3.53  [also labelled Res3_RESET]
EXT_DIO_26: X3-2.14 Z3.52  [also labelled Res3_A0]
EXT_DIO_27: X3-2.15 Z3.54  [also labelled Res3_A1]
EXT_DIO_28: X3-2.16 Z3.57  [also labelled Res3_NSAMPLE]
EXT_DIO_29: Z3.59
EXT_DIO_30: X4-1.2 Z3.58  [also labelled Res4_SPI_SDO]
EXT_DIO_31: X4-1.3 Z3.60  [also labelled Res4_SPI_SDI]
EXT_DIO_32: X4-1.4 Z3.63  [also labelled Res4_SPI_CLK]
EXT_DIO_33: X4-1.5 Z3.65  [also labelled Res4_SPI_CS]
EXT_DIO_34: X4-1.6 Z3.64  [also labelled Res4_FSYNC]
EXT_DIO_35: X4-1.7 Z3.66  [also labelled Res4_RESET]
EXT_DIO_36: X4-1.8 Z3.69  [also labelled Res4_A0]
EXT_DIO_37: X4-1.9 Z3.71  [also labelled Res4_A1]
EXT_DIO_38: X4-1.11 Z3.70  [also labelled Res4_NSAMPLE]
EXT_DIO_39: Z3.72
EXT_DIO_40: X2-1.5 Z3.75  [also labelled M1_OT_H1,2,3]
EXT_DIO_41: X2-1.9 Z3.77  [also labelled M2_OT_H1,2,3]
EXT_DIO_42: X2-1.14 Z3.76  [also labelled M3_OT_H1,2,3]
EXT_DIO_43: X2-2.4 Z3.78  [also labelled M4_OT_H1,2,3]
EXT_DIO_44: Z3.81
EXT_DIO_45: Z3.83
EXT_DIO_46: Z3.82
EXT_DIO_47: Z3.84
M1_TEMP_H1: X2-1.2
M1_TEMP_H2: X2-1.3
M1_TEMP_H3: X2-1.4
M2_TEMP_H1: X2-1.6
M2_TEMP_H2: X2-1.7
M2_TEMP_H3: X2-1.8
M3_TEMP_H1: X2-1.11
M3_TEMP_H2: X2-1.12
M3_TEMP_H3: X2-1.13
M4_TEMP_H1: X2-1.15
M4_TEMP_H2: X2-2.2
M4_TEMP_H3: X2-2.3

Not connected (* = marked no-connect by the designer): X2-1 10*; X2-2 5 6 7 8 9 11 12 13 14 15 16 17 18 19; X3-1 10*; X3-2 17 18 19; X4-1 10* 12 13 14 15; Z3 3* 4* 5* 6* 7* 8* 9* 10* 11* 12* 87* 88* 89* 90* 93* 94* 95* 96* 99* 100* 101* 102* 105* 106* 107* 108* 111* 112* 113* 114* 117* 118* 119* 120* 123* 124* 125* 126* 129* 130* 133* 134* 135* 136* 139* 140* 141* 142* 145* 146* 147*

### Notes on the sheet
- 3.3 V
- Title
- Revision:
- Design Engineer:
- Date:
- Project:
- Sheet
- of

### Library data of the parts
X2-1 X3-1 X4-1 = IPL1-115-01-L-D-K: as X1-1 on sheet ZB2; Manufacturer Part Number: IPL1-115-01-L-D-K; PartID: 28; Created On: 01.12.2020 18:14:32; ComponentLink1Description: Homepage; ComponentLink1URL: https://www.samtec.com/de/products/ipl1; Component Type: Samtec Connector; Device Package: Connector; Last Updated: 15.02.2021 10:08:03; Mounting Type: THT; Supplier 1: SAMTEC; Supplier Part Number 1: IPL1-115-01-L-D-K; Type: Connector; Live Cycle Status: 1; Number of rows: 2; Stock number: not stored
X2-2 X3-2 = IPL1-120-01-L-D-K: as X1-2 on sheet ZB2; Manufacturer Part Number: IPL1-120-01-L-D-K; PartID: 42; Created On: 24.03.2021 02:48:34; ComponentLink1Description: Homepage; ComponentLink1URL: https://www.samtec.com/products/ipl1; Component Type: Samtec Connector; Device Package: Connector; Last Updated: 27.05.2022 12:12:18; Mounting Type: THT; Supplier 1: SAMTEC; Supplier Part Number 1: IPL1-120-01-L-D-K; Type: Connector; Live Cycle Status: 1; Number of rows: 2; Stock number: not stored
Z3 = ERM8-075-02.0-L-DV-TR: as Z2 on sheet ZB2; Manufacturer Part Number: ERM8-075-02.0-L-DV-TR; PartID: 62; Created On: 15.08.2025 09:35:44; ComponentLink1Description: Datasheet; ComponentLink1URL: https://suddendocs.samtec.com/catalog_english/erm8.pdf; Last Updated: 23.09.2025 10:14:21; Mounting Type: SMD; Operating Temperature: -55 °C to +125 °C; Series: ERM8; Supplier 1: LCSC; Supplier Part Number 1: C6845629; Value: ERM8-075-02.0-L-DV-TR; LCSC Part Number: C6845629

## Nets that join several sheets
3V3: ZB1 (5 pins), ZB3 (X3-2.10)
GND: ZB1 (42 pins), ZB2 (69 pins), ZB3 (136 pins)
M1_TEMP_H1: ZB2 (Z2.119), ZB3 (X2-1.2)
M1_TEMP_H2: ZB2 (Z2.121), ZB3 (X2-1.3)
M1_TEMP_H3: ZB2 (Z2.124), ZB3 (X2-1.4)
M2_TEMP_H1: ZB2 (Z2.126), ZB3 (X2-1.6)
M2_TEMP_H2: ZB2 (Z2.129), ZB3 (X2-1.7)
M2_TEMP_H3: ZB2 (Z2.131), ZB3 (X2-1.8)
M3_TEMP_H1: ZB2 (Z2.133), ZB3 (X2-1.11)
M3_TEMP_H2: ZB2 (Z2.135), ZB3 (X2-1.12)
M3_TEMP_H3: ZB2 (Z2.130), ZB3 (X2-1.13)
M4_TEMP_H1: ZB2 (Z2.132), ZB3 (X2-1.15)
M4_TEMP_H2: ZB2 (Z2.134), ZB3 (X2-2.2)
M4_TEMP_H3: ZB2 (Z2.136), ZB3 (X2-2.3)

## Assembly variants
default: all parts fitted